# EasyEDA Pro project F446 V1.1.epro, schematic Schematic1_2
Board Name: F446plus; Create Date: 2024-09-19; Page Name: P1; Project Name: F446Plus v1.1; Schematic Name: Schematic1_2; Update Date: 2024-09-19
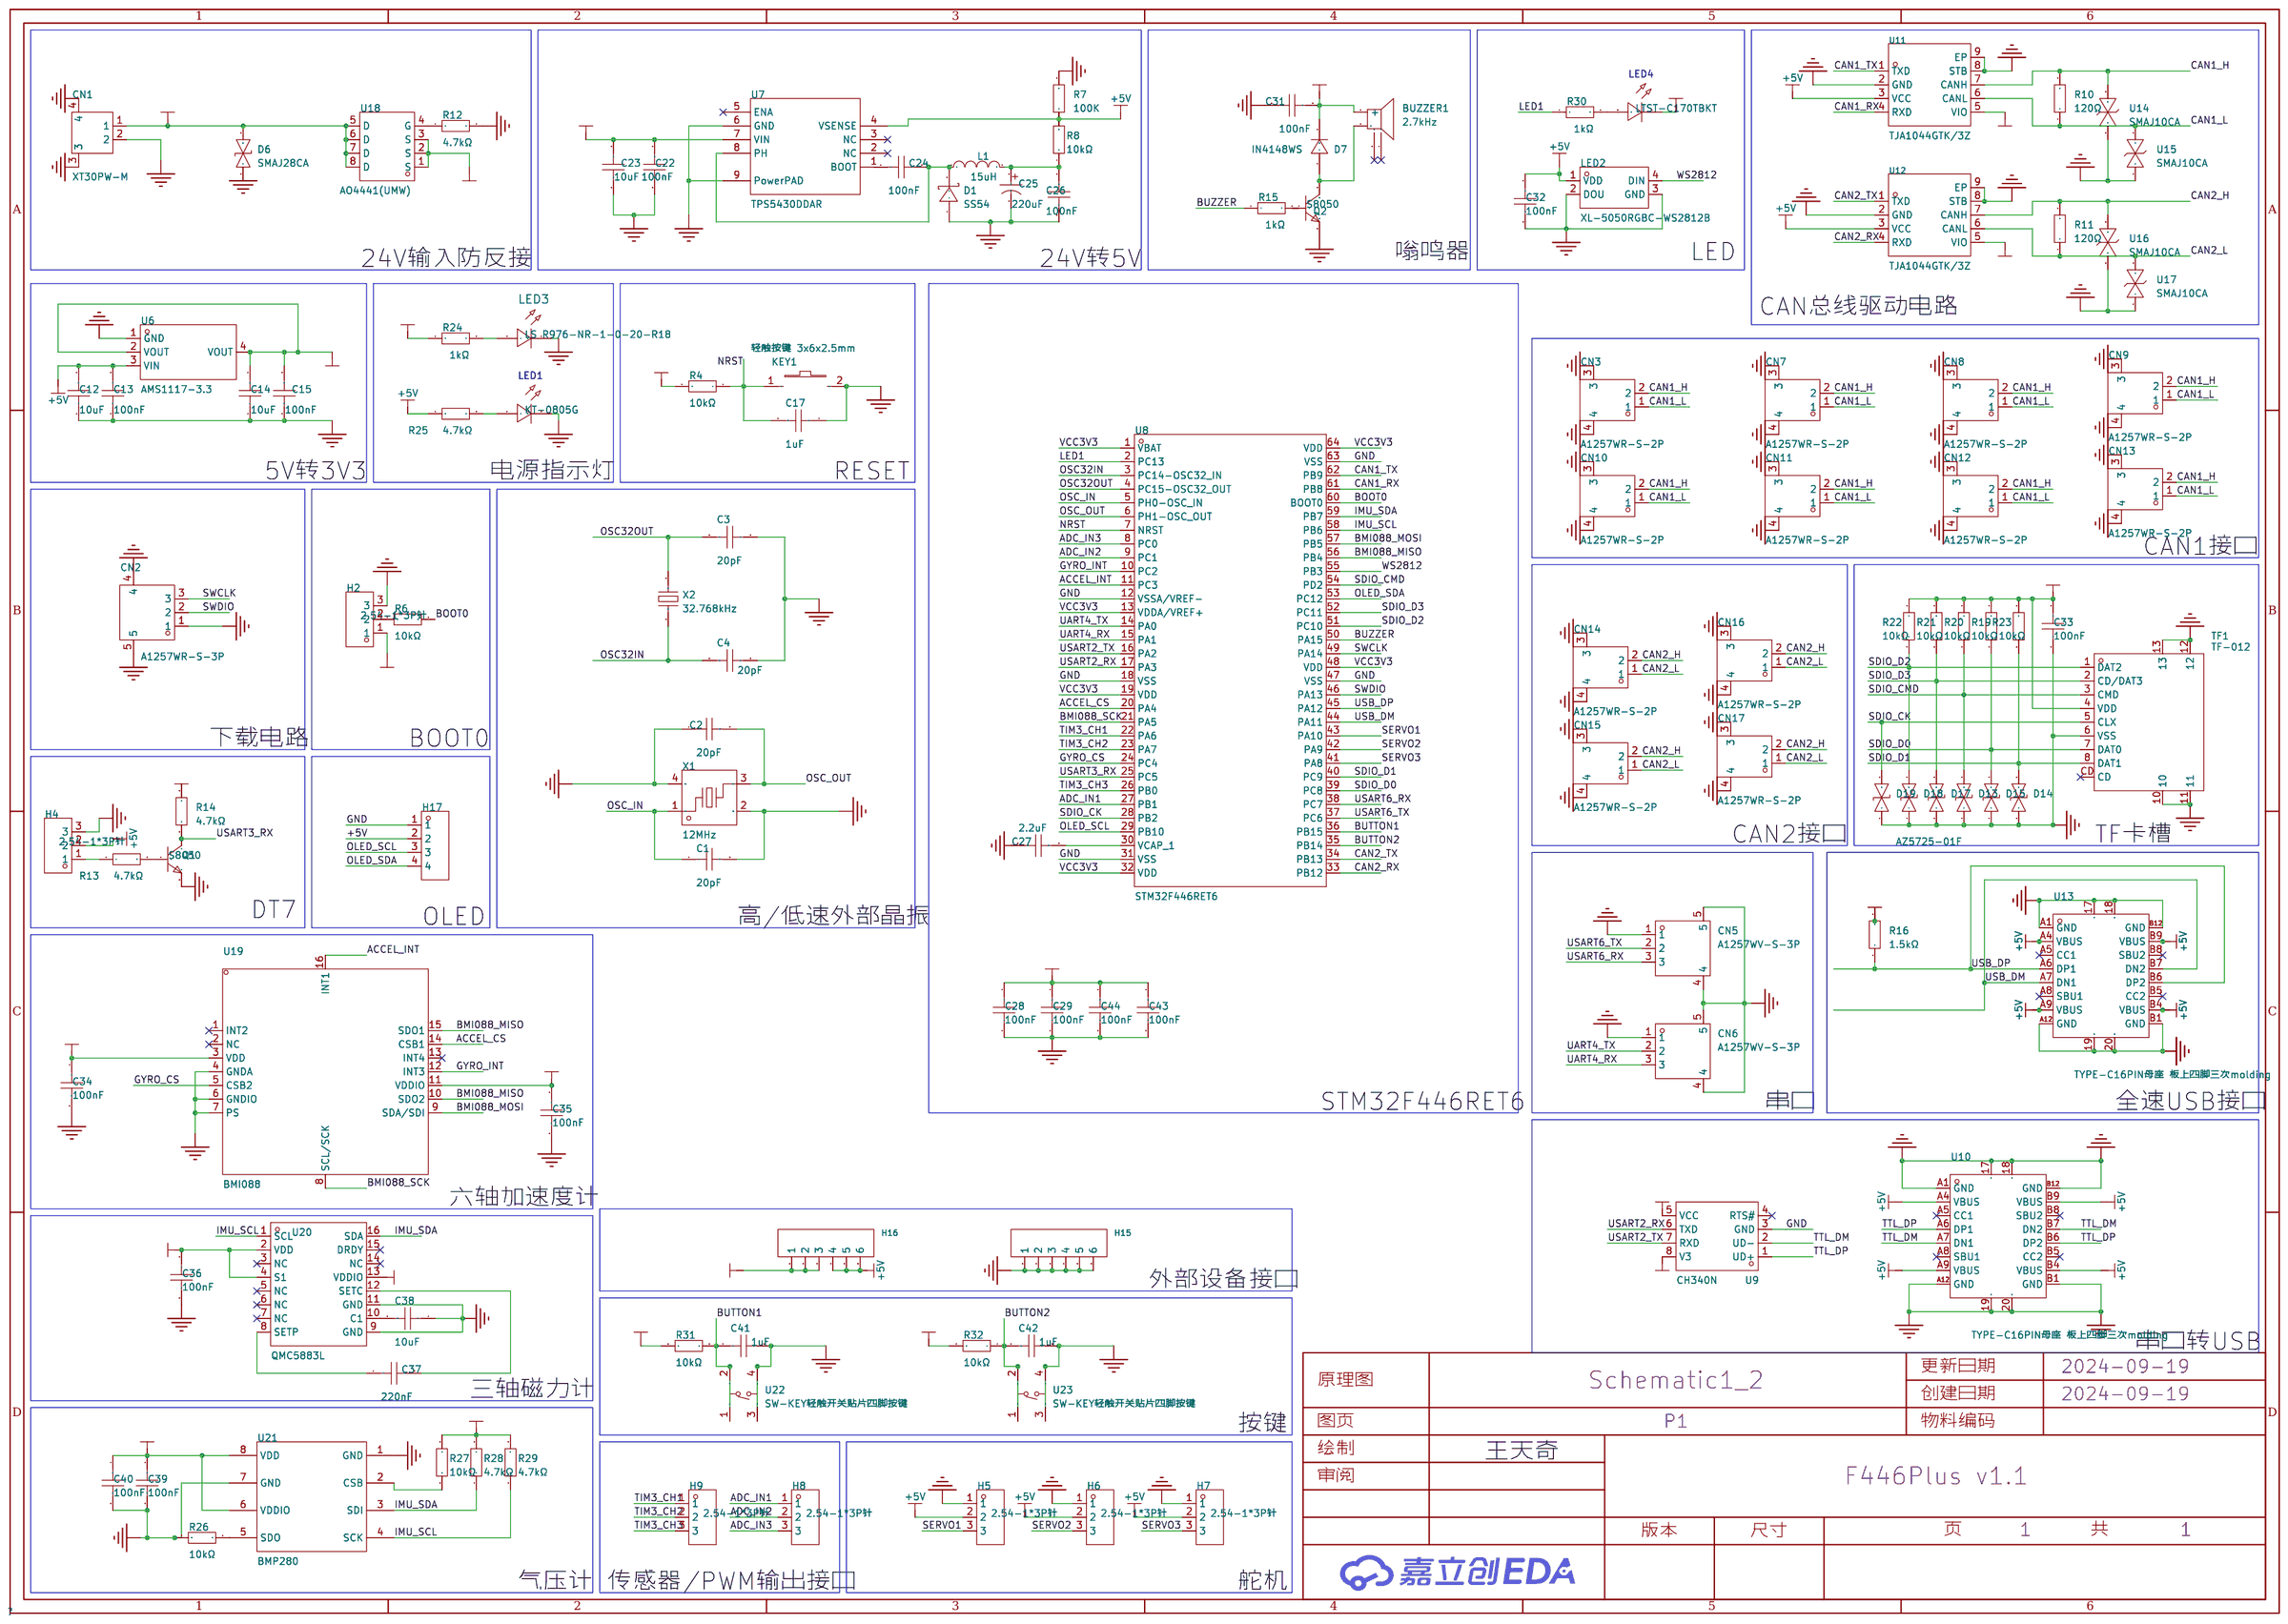
[diagram p0: schematic sheet]

## Parts
BUZZER1  2.7kHz  [BUZ-SMD_4P-L8.5-W8.5-P8.50-BR]
C1  20pF  [C0603]
C2  20pF  [C0603]
C3  20pF  [C0603]
C4  20pF  [C0603]
C12  10uF  [C0603]
C13  100nF  [C0603]
C14  10uF  [C0603]
C15  100nF  [C0603]
C17  1uF  [C0603]
C22  100nF  [C0603]
C23  10uF  [C0603]
C24  100nF  [C0603]
C25  220uF  [CAP-SMD_BD6.3-L6.6-W6.6-LS7.2-FD]
C26  100nF  [C0603]
C27  2.2uF  [C0603]
C28  100nF  [C0603]
C29  100nF  [C0603]
C31  100nF  [C0603]
C32  100nF  [C0603]
C33  100nF  [C0603]
C34  100nF  [C0603]
C35  100nF  [C0603]
C36  100nF  [C0603]
C37  220nF  [C0603]
C38  10uF  [C0603]
C39  100nF  [C0603]
C40  100nF  [C0603]
C41  1uF  [C0603]
C42  1uF  [C0603]
C43  100nF  [C0603]
C44  100nF  [C0603]
CN1  XT30PW-M  [CONN-TH_XT30PW-M]
CN2  A1257WR-S-3P  [CONN-SMD_A1257WR-S-3P]
CN3  A1257WR-S-2P  [CONN-SMD_A1257WR-S-2P]
CN5  A1257WV-S-3P  [CONN-SMD_A1257WV-S-3P]
CN6  A1257WV-S-3P  [CONN-SMD_A1257WV-S-3P]
CN7  A1257WR-S-2P  [CONN-SMD_A1257WR-S-2P]
CN8  A1257WR-S-2P  [CONN-SMD_A1257WR-S-2P]
CN9  A1257WR-S-2P  [CONN-SMD_A1257WR-S-2P]
CN10  A1257WR-S-2P  [CONN-SMD_A1257WR-S-2P]
CN11  A1257WR-S-2P  [CONN-SMD_A1257WR-S-2P]
CN12  A1257WR-S-2P  [CONN-SMD_A1257WR-S-2P]
CN13  A1257WR-S-2P  [CONN-SMD_A1257WR-S-2P]
CN14  A1257WR-S-2P  [CONN-SMD_A1257WR-S-2P]
CN15  A1257WR-S-2P  [CONN-SMD_A1257WR-S-2P]
CN16  A1257WR-S-2P  [CONN-SMD_A1257WR-S-2P]
CN17  A1257WR-S-2P  [CONN-SMD_A1257WR-S-2P]
D1  SS54  [SMA_L4.4-W2.8-LS5.4-R-RD]
D6  SMAJ28CA  [SMA_L4.3-W2.5-LS5.0-BI]
D7  IN4148WS  [SOD-323_L1.8-W1.3-LS2.5-RD]
D13  AZ5725-01F  [DFN-2L_L1.0-W0.6-P0.65-BI]
D14  AZ5725-01F  [DFN-2L_L1.0-W0.6-P0.65-BI]
D15  AZ5725-01F  [DFN-2L_L1.0-W0.6-P0.65-BI]
D17  AZ5725-01F  [DFN-2L_L1.0-W0.6-P0.65-BI]
D18  AZ5725-01F  [DFN-2L_L1.0-W0.6-P0.65-BI]
D19  AZ5725-01F  [DFN-2L_L1.0-W0.6-P0.65-BI]
H2  2.54-1*3P针  [HDR-TH_3P-P2.54-V-M-1]
H4  2.54-1*3P针  [HDR-TH_3P-P2.54-V-M-1]
H5  2.54-1*3P针  [HDR-TH_3P-P2.54-V-M-1]
H6  2.54-1*3P针  [HDR-TH_3P-P2.54-V-M-1]
H7  2.54-1*3P针  [HDR-TH_3P-P2.54-V-M-1]
H8  2.54-1*3P针  [HDR-TH_3P-P2.54-V-M-1]
H9  2.54-1*3P针  [HDR-TH_3P-P2.54-V-M-1]
H15  -  [HDR-TH_6P-P2.54-V-M-1]
H16  -  [HDR-TH_6P-P2.54-V-M-1]
H17  -  [HDR-TH_4P-P2.54-V-F]
KEY1  轻触按键 3x6x2.5mm  [SW-SMD_L6.0-W3.6-LS8.0]
L1  15uH  [IND-SMD_L7.0-W6.6_FXL0630]
LED1  KT-0805G  [LED0603-R-RD_WHITE]
LED2  XL-5050RGBC-WS2812B  [LED-SMD_4P-L5.0-W5.0-BL_XL-5050RGBC]
LED3  LS R976-NR-1-0-20-R18  [LED0603-R-RD_WHITE]
LED4  LTST-C170TBKT  [LED0603-R-RD_WHITE]
Q1  S8050  [SOT-23-3_L2.9-W1.6-P1.90-LS2.8-BR]
Q2  S8050  [SOT-23-3_L2.9-W1.6-P1.90-LS2.8-BR]
R4  10kΩ  [R0603]
R6  10kΩ  [R0603]
R7  100K  [R0603]
R8  10kΩ  [R0603]
R10  120Ω  [R0603]
R11  120Ω  [R0603]
R12  4.7kΩ  [R0603]
R13  4.7kΩ  [R0603]
R14  4.7kΩ  [R0603]
R15  1kΩ  [R0603]
R16  1.5kΩ  [R0603]
R19  10kΩ  [R0603]
R20  10kΩ  [R0603]
R21  10kΩ  [R0603]
R22  10kΩ  [R0603]
R23  10kΩ  [R0603]
R24  1kΩ  [R0603]
R25  4.7kΩ  [R0603]
R26  10kΩ  [R0603]
R27  10kΩ  [R0603]
R28  4.7kΩ  [R0603]
R29  4.7kΩ  [R0603]
R30  1kΩ  [R0603]
R31  10kΩ  [R0603]
R32  10kΩ  [R0603]
TF1  TF-012  [TF-SMD_TF-012]
U6  AMS1117-3.3  [SOT-223-3_L6.5-W3.4-P2.30-LS7.0-BR]
U7  TPS5430DDAR  [ESOP-8_L4.9-W3.9-P1.27-LS6.0-TL-EP]
U8  STM32F446RET6  [LQFP-64_L10.0-W10.0-P0.50-LS12.0-BL]
U9  CH340N  [SOP-8_L5.0-W4.0-P1.27-LS6.0-BL]
U10  TYPE-C16PIN母座 板上四脚三次molding  [USB-SMD_TYPE-C16PIN]
U11  TJA1044GTK/3Z  [HVSON-8_L3.0-W3.0-P0.65-BL-EP]
U12  TJA1044GTK/3Z  [HVSON-8_L3.0-W3.0-P0.65-BL-EP]
U13  TYPE-C16PIN母座 板上四脚三次molding  [USB-SMD_TYPE-C16PIN]
U14  SMAJ10CA  [DO-214AC_L4.3-W2.7-LS5.0-BI]
U15  SMAJ10CA  [DO-214AC_L4.3-W2.7-LS5.0-BI]
U16  SMAJ10CA  [DO-214AC_L4.3-W2.7-LS5.0-BI]
U17  SMAJ10CA  [DO-214AC_L4.3-W2.7-LS5.0-BI]
U18  AO4441(UMW)  [SOP-8_L4.9-W3.9-P1.27-LS6.0-BL]
U19  BMI088  [LGA-16_L4.5-W3.0-P0.50-BL]
U20  QMC5883L  [LGA-16_L3.0-W3.0-P0.50-BL_SQ]
U21  BMP280  [LGA-8_L2.5-W2.0-P0.65_AMP6127]
U22  SW-KEY轻触开关贴片四脚按键  [KEY-SMD_4P-L5.1-W5.1-P3.70-LS6.5]
U23  SW-KEY轻触开关贴片四脚按键  [KEY-SMD_4P-L5.1-W5.1-P3.70-LS6.5]
X1  12MHz  [OSC-SMD_4P-L3.2-W2.5-BL]
X2  32.768kHz  [OSC-SMD_L3.2-W1.5]

## Library data of the parts
BUZZER1 = MLT-8530_C94599: 驱动方式:无源(外部驱动);构造类型:电磁式;频率:2.7kHz;声压(SPL):80dB@5V,10cm;; LCSC Part Name: MLT-8530; Supplier Part: C94599; Manufacturer: 华能; Manufacturer Part: MLT-8530; Supplier Footprint: SMD,8.5x8.5mm; JLCPCB Part Class: 扩展库; Datasheet: https://atta.szlcsc.com/upload/public/pdf/source/20170522/1495448322339.pdf; Supplier: LCSC; Oscillator Circuit: 无源(外部驱动); Technology Type: 电磁式; Operating Voltage: 2.5V~4.5V; Sound Pressure Level (SPL): 80dB@5V,10cm; Length: 8.5mm; Width: 8.5mm; Height: 3.3mm
C1-C4 = CL21C200JBANNNC: 容值:20pF;精度:±5%;额定电压:50V;材质(温度系数):C0G;; LCSC Part Name: 20pF ±5% 50V; Supplier Part: C1798; Manufacturer: SAMSUNG(三星); Supplier Footprint: 0805; JLCPCB Part Class: Basic Part; Datasheet: https://atta.szlcsc.com/upload/public/pdf/source/20160218/1457707763339.pdf; Supplier: LCSC; Tolerance: ±5%; Voltage Rated: 50V; Temperature Coefficient: C0G
C12 C14 C23 C38 = CL21A106KAYNNNE_C15850: 容值:10uF;精度:±10%;额定电压:25V;材质(温度系数):X5R;; LCSC Part Name: 10uF ±10% 25V; Supplier Part: C15850; Manufacturer: SAMSUNG(三星); Manufacturer Part: CL21A106KAYNNNE; Supplier Footprint: 0805; JLCPCB Part Class: Basic Part; Datasheet: https://atta.szlcsc.com/upload/public/pdf/source/20160218/1457707763339.pdf; Supplier: LCSC; Tolerance: ±10%; Voltage Rated: 25V; Temperature Coefficient: X5R
C13 C15 C22 C24 C26 C28 C29 C31-C36 C39 C40 C43 C44 = CC0805KRX7R9BB104: 容值:100nF;精度:±10%;额定电压:50V;材质(温度系数):X7R;; LCSC Part Name: 100nF ±10% 50V; Supplier Part: C49678; Manufacturer: YAGEO(国巨); Supplier Footprint: 0805; JLCPCB Part Class: Basic Part; Datasheet: https://atta.szlcsc.com/upload/public/pdf/source/20180224/C181747_15194369449651363981.pdf; Supplier: LCSC; Tolerance: ±10%; Voltage Rated: 50V; Temperature Coefficient: X7R
C17 C41 C42 = CL21B105KBFNNNE: 容值:1uF;精度:±10%;额定电压:50V;材质(温度系数):X7R;; LCSC Part Name: 1uF ±10% 50V; Supplier Part: C28323; Manufacturer: SAMSUNG(三星); Supplier Footprint: 0805; JLCPCB Part Class: Basic Part; Datasheet: https://atta.szlcsc.com/upload/public/pdf/source/20160218/1457707763339.pdf; Supplier: LCSC; Tolerance: ±10%; Voltage Rated: 50V; Temperature Coefficient: X7R
C25 = 220uF: Supplier Part: C2941234; Supplier Footprint: -SMD6.3/5.8; JLCPCB Part Class: 扩展库; Datasheet: 2021-12-31/358175A/64285bfd35de4d0cb0247d8988fc0d91/220UF16V_2018-09-21.PDF; Supplier: LCSC
C27 = CL21A225KBQNNNE: 容值:2.2uF;精度:±10%;额定电压:50V;材质(温度系数):X5R;; LCSC Part Name: 2.2uF ±10% 50V; Supplier Part: C377773; Manufacturer: SAMSUNG(三星); Supplier Footprint: 0805; JLCPCB Part Class: Basic Part; Datasheet: https://atta.szlcsc.com/upload/public/pdf/source/20160218/1457707763339.pdf; Supplier: LCSC; Tolerance: ±10%; Voltage Rated: 50V; Temperature Coefficient: X5R
C37 = CL21B224KBFNNNE: 容值:220nF;精度:±10%;额定电压:50V;材质(温度系数):X7R;; LCSC Part Name: 220nF ±10% 50V; Supplier Part: C5378; Manufacturer: SAMSUNG(三星); Supplier Footprint: 0805; JLCPCB Part Class: Basic Part; Datasheet: https://atta.szlcsc.com/upload/public/pdf/source/20160218/1457707763339.pdf; Supplier: LCSC; Tolerance: ±10%; Voltage Rated: 50V; Temperature Coefficient: X7R
CN1 = XT30PW-M: 类别:-;类型1:-;; LCSC Part Name: AMASS(艾迈斯)航模插头 卧式弯脚 XT30PW-M公头; Supplier Part: C431092; Manufacturer: AMASS(艾迈斯); JLCPCB Part Class: 扩展库; Datasheet: https://atta.szlcsc.com/upload/public/pdf/source/20220222/6A9F22F7850E25B33E1BE430ADF8560B.pdf; Supplier: LCSC; Brand: 艾迈斯; Type: 航模插头; RatedVoltage: DC 500V; InterfaceType: 公头; RatedCurrent: 15A; RecommendedWireGauge: 16/18/20AWG; contact resistance: 1.2mΩ; specifications: 2pin
CN2 = A1257WR-S-3P: 插针结构:1x3P;间距:1.25mm;安装方式:-;参考系列:GH;总PIN数:3P;排数:1;每排PIN数:3;行距:-;触头材质:黄铜;; LCSC Part Name: 系列:GH 间距:1.25mm 1x3P; Supplier Part: C225126; Manufacturer: CJT(长江连接器); Supplier Footprint: SMD,P=1.25mm,卧贴; JLCPCB Part Class: 扩展库; Datasheet: https://atta.szlcsc.com/upload/public/pdf/source/20181008/C272994_C9E89FA8A36D0009CAD30AD8C59C2782.pdf; Supplier: LCSC; Pins Structure: 1x3P; Pitch: 1.25mm; Reference Series: GH; Number of Pins: 3P; Number of Rows: 1; Number of PINs Per Row: 3; Contact Material: 黄铜
CN3 CN7-CN17 = A1257WR-S-2P: 插针结构:1x2P;间距:1.25mm;安装方式:-;参考系列:GH;总PIN数:2P;排数:1;每排PIN数:2;行距:-;触头材质:黄铜;; LCSC Part Name: 系列:GH 间距:1.25mm 1x2P; Supplier Part: C225125; Manufacturer: CJT(长江连接器); Supplier Footprint: SMD,P=1.25mm,卧贴; JLCPCB Part Class: 扩展库; Datasheet: https://atta.szlcsc.com/upload/public/pdf/source/20181008/C272994_C9E89FA8A36D0009CAD30AD8C59C2782.pdf; Supplier: LCSC; Pins Structure: 1x2P; Pitch: 1.25mm; Reference Series: GH; Number of Pins: 2P; Number of Rows: 1; Number of PINs Per Row: 2; Contact Material: 黄铜
CN5 CN6 = A1257WV-S-3P: 插针结构:1x3P;间距:1.25mm;安装方式:-;参考系列:GH;总PIN数:3P;排数:1;每排PIN数:3;行距:-;触头材质:黄铜;; LCSC Part Name: 系列:GH 间距:1.25mm 1x3P; Supplier Part: C225119; Manufacturer: CJT(长江连接器); Supplier Footprint: SMD,P=1.25mm; JLCPCB Part Class: 扩展库; Datasheet: https://atta.szlcsc.com/upload/public/pdf/source/20181008/C272994_C9E89FA8A36D0009CAD30AD8C59C2782.pdf; Supplier: LCSC; Pins Structure: 1x3P; Pitch: 1.25mm; Reference Series: GH; Number of Pins: 3P; Number of Rows: 1; Number of PINs Per Row: 3; Contact Material: 黄铜
D1 = SS54_C22452: 二极管配置:独立式;正向压降(Vf):550mV@5A;直流反向耐压(Vr):40V;整流电流:5A;; LCSC Part Name: 电压:40V 电流:5A; Supplier Part: C22452; Manufacturer: MDD(辰达半导体); Supplier Footprint: SMA(DO-214AC); JLCPCB Part Class: 基础库; Datasheet: https://atta.szlcsc.com/upload/public/pdf/source/20230314/529CD85F9B31F69841D3A079BC07E377.pdf; Supplier: LCSC; Diode Configuration: 独立式; Forward Voltage (Vf@If): 550mV@5A; Reverse Voltage (Vr): 40V; Rectified Current: 5A; Reverse Leakage Current (Ir): 1mA@40V
D6 = SMAJ28CA_C353457: 反向截止电压(Vrwm):28V;最大钳位电压:45.4V;峰值脉冲电流(Ipp)@10/1000us:8.8A;击穿电压:31.1V;; LCSC Part Name: 双向TVS 28V截止 8.8A峰值脉冲; Supplier Part: C353457; Manufacturer: 晶导微电子; Supplier Footprint: SMA; JLCPCB Part Class: 扩展库; Datasheet: https://atta.szlcsc.com/upload/public/pdf/source/20190103/C353498_9C52E1B7CA7D9691073072057BB1DA1A.pdf; Supplier: LCSC; Reverse Stand-Off Voltage (Vrwm): 28V; Maximum Clamping Voltage: 45.4V; Peak Pulse Current (Ipp)@10/1000us: 8.8A; Breakdown Voltage: 31.1V; Reverse Leakage Current (Ir): 1uA; Type: TVS
D7 = IN4148WS: 二极管配置:独立式;正向压降(Vf):1V@10mA;直流反向耐压(Vr):100V;平均整流电流(Io):200mA;功率:200mW;反向恢复时间(trr):4ns;; LCSC Part Name: 电压:100V 电流:200mA; Supplier Part: C417545; Manufacturer: LRC(乐山无线电); Supplier Footprint: SOD-323; JLCPCB Part Class: 扩展库; Datasheet: https://atta.szlcsc.com/upload/public/pdf/source/20190911/C417545_CB999573A39316D3E44B0FF1B4B78E30.pdf; Supplier: LCSC; Diode Configuration: 独立式; Forward Voltage (Vf@If): 1V@10mA; Reverse Voltage (Vr): 100V; Average Rectified Current (Io): 200mA; Power Dissipation: 200mW; Reverse Leakage Current: 5uA@75V; Reverse Recovery Time (trr): 4ns
D13-D15 D17-D19 = AZ5725-01F: LCSC Part Name: ESD二极管; Supplier Part: C2936978; Manufacturer: TECH PUBLIC(台舟); Supplier Footprint: DFN1006-2; JLCPCB Part Class: 扩展库; Datasheet: https://atta.szlcsc.com/upload/public/pdf/source/20211227/A9A7998FC1FA86EA4F8BFE76327F88B0.pdf; Supplier: LCSC
H2 H4-H9 = 2.54-1*3P针: 插针结构:1x3P;间距:2.54mm;行距:-;圆针/方针:方针;安装类型:直插;排数:单排;总PIN位数:3P;额定电流:3A;额定电压:-;配合针长度:-;塑高:-;端接针长度:-;触头材质:-;触头镀层:-;工作温度范围:-40℃~+105℃;颜色:黑色;; LCSC Part Name: 间距:2.54mm 1x3P 直插 方针; Supplier Part: C49257; Manufacturer: BOOMELE(博穆精密); Supplier Footprint: 插件,P=2.54mm; JLCPCB Part Class: Extended Part; Datasheet: https://atta.szlcsc.com/upload/public/pdf/source/20221018/3E9408392E35E6F57A28985E5F7BF5C9.pdf; Supplier: LCSC; Pin Structure: 1x3P; Pitch: 2.54mm; Circluar Pins/Square Pins: 方针; Mounting Type: 直插; Number of Rows: 单排; Number of Pins: 3P; Current Rating (Max): 3A; Operating Temperature Range: -40℃~+105℃; Color: 黑色
H15 H16 = HDR-M_2.54_1x6P: Supplier Part: C37208; Supplier Footprint: 插件
H17 = HDR-F_2.54_1x4P: Supplier Part: C2718488; Supplier Footprint: 插件
KEY1 = 轻触按键 3x6x2.5mm: LCSC Part Name: 3x6x2.5 红头 耐高温; Supplier Part: C5382; Supplier Footprint: SMD; JLCPCB Part Class: 扩展库; Supplier: LCSC
L1 = FXL0630-150-M: 电感值:15uH;精度:±20%;额定电流:3A;饱和电流(Isat):4.5A;类型:一体成型电感;; LCSC Part Name: 15uH ±20% 4.5A; Supplier Part: C177243; Manufacturer: cjiang(长江微电); Supplier Footprint: SMD,6.6x7mm; JLCPCB Part Class: Extended Part; Datasheet: https://atta.szlcsc.com/upload/public/pdf/source/20230516/3A080F5AF8C87BB81C3BA86E5F60E51A.pdf; Supplier: LCSC; Tolerance: ±20%; Rated Current: 3A; Saturation Current (Isat): 4.5A; DC Resistance (DCR): 115mΩ; Type: 一体成型电感; Q @ Freq: 25@1MHz; Frequency - Self Resonant: 19MHz
LED1 = KT-0805G: 灯头类型:-;发光颜色:翠绿色;正向电压(VF):-;功率:-;正向电流:-;主波长:-;二极管配置:-;透镜颜色:-;色温:-;发光强度:-;发光角度:-;载带方式:-;工作温度:-;; LCSC Part Name: 0805 翠绿 高亮; Supplier Part: C2297; Manufacturer: KENTO; Supplier Footprint: 0805; JLCPCB Part Class: Basic Part; Datasheet: https://atta.szlcsc.com/upload/public/pdf/source/20170209/1486607340485.pdf; Supplier: LCSC; Emitted Color: 翠绿色
LED2 = XL-5050RGBC-WS2812B: 5050七彩幻彩透明贴片LED灯珠 5050 幻彩透明四脚 ws2812B 内置驱动IC; Supplier Part: C2843785; Manufacturer: XINGLIGHT(成兴光); Supplier Footprint: SMD5050; JLCPCB Part Class: 扩展库; Datasheet: https://atta.szlcsc.com/upload/public/pdf/source/20240412/E1004CAA80592E31D08BFE019083806F.pdf; Supplier: LCSC
LED3 = LS R976-NR-1-0-20-R18: LCSC Part Name: 0805红(雾状); Supplier Part: C2899997; Manufacturer: OSRAM(欧司朗); Supplier Footprint: 0805; JLCPCB Part Class: Extended Part; Datasheet: https://atta.szlcsc.com/upload/public/pdf/source/20220714/A56A54169E2209C0CCFAD963EE2FAFD1.pdf; Supplier: LCSC
LED4 = LTST-C170TBKT: 发光颜色:蓝色;正向电压(VF):3.3V;功率:76mW;正向电流:20mA;主波长:465nm~475nm;二极管配置:-;透镜颜色:无色透明透镜;色温:-;发光强度:104mcd;发光角度:130°;载带方式:-;工作温度:-20℃~+80℃;; LCSC Part Name: 蓝灯; Supplier Part: C98222; Manufacturer: LITEON(光宝); Supplier Footprint: 0805; JLCPCB Part Class: Extended Part; Datasheet: https://atta.szlcsc.com/upload/public/pdf/source/20171026/C98222_15089842934011059296.pdf; Supplier: LCSC; Emitted Color: 蓝色; Forward Voltage (VF): 3.3V; Power Dissipation: 76mW; Forward Current: 20mA; Dominant Wavelength: 465nm~475nm; Peak Wavelength: 468nm; Lens Color: 无色透明透镜; Luminous Intensity: 104mcd; Viewing Angle: 130°; Operating Temperature: -20℃~+80℃
Q1 Q2 = S8050_C181158: 晶体管类型:NPN;集电极电流(Ic):500mA;集射极击穿电压(Vceo):25V;功率(Pd):300mW;; LCSC Part Name: NPN 电流:500mA 耐压:25V; Supplier Part: C181158; Manufacturer: Hottech(合科泰); Supplier Footprint: SOT-23; JLCPCB Part Class: Extended Part; Datasheet: https://atta.szlcsc.com/upload/public/pdf/source/20220506/D987F39D56F2975D34EC7947E75C4ABC.pdf; Supplier: LCSC; Transistor Type: NPN; Collector Current (Ic): 500mA; Collector-Emitter Breakdown Voltage (Vceo): 25V; Power Dissipation (Pd): 300mW; Transition Frequency (fT): 150MHz; Collector Cut-Off Current (Icbo): 100nA; Collector-Emitter Saturation Voltage (VCE(sat)@Ic,Ib): 600mV@500mA,50mA
R4 R6 R8 R19-R23 R26 R27 R31 R32 = RC0805FR-0710KL: 电阻类型:厚膜电阻;阻值:10kΩ;精度:±1%;功率:125mW;最大工作电压:150V;温度系数:±100ppm/℃;; LCSC Part Name: 厚膜电阻 10kΩ ±1% 125mW; Supplier Part: C84376; Manufacturer: YAGEO(国巨); Supplier Footprint: 0805; JLCPCB Part Class: Extended Part; Datasheet: https://atta.szlcsc.com/upload/public/pdf/source/20170708/1499509500945.pdf; Supplier: LCSC; Type: 厚膜电阻; Tolerance: ±1%; Power(Watts): 125mW; Overload Voltage (Max): 150V; Temperature Coefficient: ±100ppm/℃; Operating Temperature Range: -55℃~+155℃
R7 = 0805W8F3241T5E: 电阻类型:厚膜电阻;阻值:3.24kΩ;精度:±1%;功率:125mW;最大工作电压:150V;温度系数:±100ppm/℃;; LCSC Part Name: 3.24kΩ ±1% 125mW 厚膜电阻; Supplier Part: C17609; Manufacturer: UNI-ROYAL(厚声); Supplier Footprint: 0805; JLCPCB Part Class: Extended Part; Datasheet: https://atta.szlcsc.com/upload/public/pdf/source/20200306/C422600_1E6D84923E4A46A82E41ADD87F860B5C.pdf; Supplier: LCSC; Type: 厚膜电阻; Tolerance: ±1%; Power(Watts): 125mW; Overload Voltage (Max): 150V; Temperature Coefficient: ±100ppm/℃; Operating Temperature Range: -55℃~+155℃
R10 R11 = 0805W8F1200T5E: 电阻类型:厚膜电阻;阻值:120Ω;精度:±1%;功率:125mW;最大工作电压:150V;温度系数:±100ppm/℃;; LCSC Part Name: 120Ω ±1% 125mW 厚膜电阻; Supplier Part: C17437; Manufacturer: UNI-ROYAL(厚声); Supplier Footprint: 0805; JLCPCB Part Class: Basic Part; Datasheet: https://atta.szlcsc.com/upload/public/pdf/source/20200306/C422600_1E6D84923E4A46A82E41ADD87F860B5C.pdf; Supplier: LCSC; Type: 厚膜电阻; Tolerance: ±1%; Power(Watts): 125mW; Overload Voltage (Max): 150V; Temperature Coefficient: ±100ppm/℃; Operating Temperature Range: -55℃~+155℃
R12-R14 R25 R28 R29 = 0805W8J0472T5E: 电阻类型:厚膜电阻;阻值:4.7kΩ;精度:±5%;功率:125mW;最大工作电压:150V;温度系数:±100ppm/℃;; LCSC Part Name: 4.7kΩ ±5% 125mW 厚膜电阻; Supplier Part: C26022; Manufacturer: UNI-ROYAL(厚声); Supplier Footprint: 0805; JLCPCB Part Class: Extended Part; Datasheet: https://atta.szlcsc.com/upload/public/pdf/source/20200306/C422600_1E6D84923E4A46A82E41ADD87F860B5C.pdf; Supplier: LCSC; Type: 厚膜电阻; Tolerance: ±5%; Power(Watts): 125mW; Overload Voltage (Max): 150V; Temperature Coefficient: ±100ppm/℃; Operating Temperature Range: -55℃~+155℃
R15 R24 R30 = 0805W8F1001T5E: 电阻类型:厚膜电阻;阻值:1kΩ;精度:±1%;功率:125mW;最大工作电压:150V;温度系数:±100ppm/℃;; LCSC Part Name: 1kΩ ±1% 125mW 厚膜电阻; Supplier Part: C17513; Manufacturer: UNI-ROYAL(厚声); Supplier Footprint: 0805; JLCPCB Part Class: Basic Part; Datasheet: https://atta.szlcsc.com/upload/public/pdf/source/20200306/C422600_1E6D84923E4A46A82E41ADD87F860B5C.pdf; Supplier: LCSC; Type: 厚膜电阻; Tolerance: ±1%; Power(Watts): 125mW; Overload Voltage (Max): 150V; Temperature Coefficient: ±100ppm/℃; Operating Temperature Range: -55℃~+155℃
R16 = 0805W8F1501T5E: 电阻类型:厚膜电阻;阻值:1.5kΩ;精度:±1%;功率:125mW;最大工作电压:150V;温度系数:±100ppm/℃;; LCSC Part Name: 1.5kΩ ±1% 125mW 厚膜电阻; Supplier Part: C4310; Manufacturer: UNI-ROYAL(厚声); Supplier Footprint: 0805; JLCPCB Part Class: Basic Part; Datasheet: https://atta.szlcsc.com/upload/public/pdf/source/20200306/C422600_1E6D84923E4A46A82E41ADD87F860B5C.pdf; Supplier: LCSC; Type: 厚膜电阻; Tolerance: ±1%; Power(Watts): 125mW; Overload Voltage (Max): 150V; Temperature Coefficient: ±100ppm/℃; Operating Temperature Range: -55℃~+155℃
TF1 = TF-012: 卡连接方式:自弹式;卡类型:MicroSD卡(TF卡);连接器类型:卡座;本体最大高度:2mm;触头镀层:金;工作温度范围:-25℃~+85℃;; LCSC Part Name: 自弹式 MicroSD卡(TF卡) 卡座; Supplier Part: C410350; Manufacturer: HANBO(汉博); Supplier Footprint: SMD; JLCPCB Part Class: 扩展库; Datasheet: https://atta.szlcsc.com/upload/public/pdf/source/20221111/BB81CC7778DE10777740A0A95254EE6F.pdf; Supplier: LCSC; Card Connection Mode: 自弹式; Card Type: MicroSD卡(TF卡); Connector Type: 卡座; Maximum Body Height: 2mm; Contact Plating: 金; Operating Temperature Range: -25℃~+85℃
U6 = AMS1117-3.3_C6186: 输出类型:固定;最大输入电压:-;输出电压:3.3V;最大输出电流:1A;电源纹波抑制比(PSRR):72dB@(120Hz);输出极性:正极;; LCSC Part Name: 输出3.3V 1A; Supplier Part: C6186; Manufacturer: AMS; Supplier Footprint: SOT-223; JLCPCB Part Class: 基础库; Datasheet: https://atta.szlcsc.com/upload/public/pdf/source/20180727/C6186_7A095716F0823C02F1997A905E26C086.pdf; Supplier: LCSC; Output Type: 固定; Output Voltage: 3.3V; MAX Output Current: 1A; Power Supply Rejection Ratio (PSRR): 72dB@(120Hz); Dropout Voltage: 1.3V@(800mA); Output Polarity: 正极; Number of Outputs: 1
U7 = TPS5430DDAR: 功能类型:降压型;输出类型:可调;输入电压:5.5V~36V;输出电压:1.221V~32.04V;输出电流(最大值):3A;; LCSC Part Name: 降压 3A 36V; Supplier Part: C9864; Manufacturer: TI(德州仪器); Supplier Footprint: SOIC-8-EP; JLCPCB Part Class: 基础库; Datasheet: https://www.ti.com/cn/lit/gpn/tps5430; Supplier: LCSC; Function: 降压型; Output Type: 可调; Input Voltage: 5.5V~36V; Output Voltage: 1.221V~32.04V; Output Current (Max): 3A; Switching Frequency: 500kHz; Operating Temperature: -40℃~+125℃@(TJ); Synchronous Rectification: 否; Number of Outputs: 1; Topology: 降压式; Switch tube (built-in/external): 内置
U8 = STM32F446RET6: CPU内核:CM4;程序存储容量:512KB;RAM总容量:128KB;GPIO端口数量:50;工作电压范围:1.7V~3.6V;CPU最大主频:180MHz;程序存储器类型:FLASH;; LCSC Part Name: STM32F446RET6 MSL=3; Supplier Part: C69336; Manufacturer: ST(意法半导体); Supplier Footprint: LQFP-64(10x10); JLCPCB Part Class: 扩展库; Datasheet: https://atta.szlcsc.com/upload/public/pdf/source/20170518/1495086068896.pdf; Supplier: LCSC; CPU Core: CM4; Program Storage Size: 512KB; RAM Size: 128KB; GPIO Ports Number: 50; Operating Voltage Range: 1.7V~3.6V; CPU Maximum Speed: 180MHz; Program Memory Type: FLASH; Operating Temperature Range: -40℃~+85℃; ADC (Bit): 12bit; DAC (Bit): 12bit; Universal Serial Bus: 有; Peripheral/Function: PWM；PWM；低电压检测; Watchdog: 有; Infrared Data Association: 有; Low-Voltage Detect: 有; Direct Memory Access: 有; Internal Oscillator: 有
U9 = CH340N_C506813: 应用功能:-;接口协议:-;; LCSC Part Name: USB转串口芯片 CH340; Supplier Part: C506813; Manufacturer: WCH(南京沁恒); Supplier Footprint: SOP-8; JLCPCB Part Class: 扩展库; Datasheet: https://atta.szlcsc.com/upload/public/pdf/source/20200819/C84681_ADBED554CE321879DBD6B1D06488689C.pdf; Supplier: LCSC
U10 U13 = TYPE-C16PIN母座 板上四脚三次molding: Supplier Part: C9900000202; Supplier Footprint: TYPE-C16PIN; JLCPCB Part Class: Extended Part; Supplier: LCSC
U11 U12 = TJA1044GTK/3Z: 类型:-;; Supplier Part: C2157795; Manufacturer: NXP(恩智浦); Supplier Footprint: HVSON-8-EP(3x3); JLCPCB Part Class: 扩展库; Datasheet: https://atta.szlcsc.com/upload/public/pdf/source/20180227/C181725_15196977259441370130.pdf; Supplier: LCSC
U14-U17 = SMAJ10CA_C19077530: 极性:双向;反向截止电压(Vrwm):10V;最大钳位电压:17V;峰值脉冲电流(Ipp)@10/1000us:23.5A;峰值脉冲功率(Ppp)@10/1000us:400W;击穿电压:12.3V;; Supplier Part: C19077530; Manufacturer: 宏迦橙; Supplier Footprint: SMA; JLCPCB Part Class: 扩展库; Datasheet: https://atta.szlcsc.com/upload/public/pdf/source/20231129/0C227A9DBE0C7CC8A214145DDE9DB6E3.pdf; Supplier: LCSC; polarity: 双向; Reverse Stand-Off Voltage (Vrwm): 10V; Maximum Clamping Voltage: 17V; Peak Pulse Current (Ipp)@10/1000us: 23.5A; Peak Pulse Power Dissipation (Ppp)@10/1000us: 400W; Breakdown Voltage: 12.3V; Reverse Leakage Current (Ir): 5uA; Operating Temperature: -55℃~+155℃; Type: TVS
U18 = AO4441(UMW): LCSC Part Name: AO4441; Supplier Part: C5447653; Manufacturer: UMW(友台半导体); Supplier Footprint: SOP-8; Datasheet: https://atta.szlcsc.com/upload/public/pdf/source/20231109/A658EA3DE7C4AD03D844DCD51B9B6F86.pdf; Supplier: LCSC
U19 = BMI088: 传感器类型:加速度计陀螺仪;; Supplier Part: C194919; Manufacturer: Bosch(博世); Supplier Footprint: LGA-16(3x4.5); JLCPCB Part Class: 扩展库; Datasheet: https://atta.szlcsc.com/upload/public/pdf/source/20180628/C194919_66CCF125FF968C218A4D358C68AC68D6.pdf; Supplier: LCSC; Sensor Type: 加速度计陀螺仪; Operating Temperature: -40℃~+85℃
U20 = QMC5883L: LCSC Part Name: 三轴磁传感器; Supplier Part: C976032; Manufacturer: QST(上海矽睿); Supplier Footprint: LGA-16(3x3); JLCPCB Part Class: 扩展库; Datasheet: https://atta.szlcsc.com/upload/public/pdf/source/20201217/C976032_5B9A2F3901E175046CBA037B1F18A1F2.pdf; Supplier: LCSC
U21 = BMP280: Bosch气压传感器新品，可测量大气压力，带高精度温度测量，可校准精确计算海拔高度。I2C或SPI接口，宽量程（300-1100hpa），精度高; Supplier Part: C83291; Manufacturer: Bosch(博世); Supplier Footprint: LGA-8(2x2.5); JLCPCB Part Class: 扩展库; Datasheet: https://atta.szlcsc.com/upload/public/pdf/source/20200702/C83291_F39E84AB7DFC569A4C7554F8659640A1.pdf; Supplier: LCSC
U22 U23 = SW-KEY轻触开关贴片四脚按键: Supplier Part: C9900002561; Supplier Footprint: SMD-4_L5.1-W5.1-P3.70-LS6.5; JLCPCB Part Class: 扩展库; Supplier: LCSC
X1 = 7B012000M01: 晶振类型:贴片晶振;频率:12MHz;常温频差:±10ppm;外接负载电容:12pF;频率稳定度(全温):±20ppm;; LCSC Part Name: 12MHz ±10ppm 12pF; Supplier Part: C654949; Manufacturer: HD(浩都频率); Supplier Footprint: SMD3225-4P; JLCPCB Part Class: 扩展库; Datasheet: https://atta.szlcsc.com/upload/public/pdf/source/20220223/8471DDD7AD9521F45DA205F3B23502E0.pdf; Supplier: LCSC; Crystal Type: 贴片晶振; Normal temperature Frequency Tolerance: ±10ppm; External load capacitor: 12pF; Frequency Stability(Full temperature range): ±20ppm
X2 = X321532768KGD2SI: 晶振类型:贴片晶振;频率:32.768kHz;常温频差:±20ppm;外接负载电容:12.5pF;频率稳定度(全温):-;; LCSC Part Name: 32.768kHz ±20ppm 12.5pF; Supplier Part: C620155; Manufacturer: YXC(扬兴晶振); Supplier Footprint: SMD3215-2P; JLCPCB Part Class: 扩展库; Datasheet: https://atta.szlcsc.com/upload/public/pdf/source/20240329/3A7650FD985DD0DE85694D3785AB4916.pdf; Supplier: LCSC; Crystal Type: 贴片晶振; Normal temperature Frequency Tolerance: ±20ppm; External load capacitor: 12.5pF; Operating Temperature: -40℃~+85℃

## Nets
+5V: C12.2 C13.2 C32.1 H4.2 H5.2 H6.2 H7.2 H16.4 H16.5 H16.6 H17.2 LED2.1(VDD) R7.1 R8.2 R25.1 U6.3(VIN) U7.4(VSENSE) U10.A4(VBUS) U10.A9(VBUS) U10.B4(VBUS) U10.B9(VBUS) U11.3(VCC) U12.3(VCC) U13.A4(VBUS) U13.A9(VBUS) U13.B4(VBUS) U13.B9(VBUS)
GND: C1.2 C2.1 C3.2 C4.2 C12.1 C13.1 C14.1 C15.1 C17.1 C22.1 C23.1 C25.2 C26.1 C27.2 C28.2 C29.2 C31.1 C32.2 C33.2 C34.2 C35.2 C36.2 C38.1 C39.2 C40.2 C41.2 C42.2 C43.2 C44.2 CN1.2 CN1.3 CN1.4 CN2.1 CN2.4 CN2.5 CN3.3 CN3.4 CN5.1 CN5.4 CN5.5 CN6.1 CN6.4 CN6.5 CN7.3 CN7.4 CN8.3 CN8.4 CN9.3 CN9.4 CN10.3 CN10.4 CN11.3 CN11.4 CN12.3 CN12.4 CN13.3 CN13.4 CN14.3 CN14.4 CN15.3 CN15.4 CN16.3 CN16.4 CN17.3 CN17.4 D1.1(A) D6.1 D13.1 D14.1 D15.1 D17.1 D18.1 D19.1 H2.3 H4.3 H5.1 H6.1 H7.1 H15.1 H15.2 H15.3 H15.4 H15.5 H15.6 H17.1 KEY1.2 LED1.1(C) LED2.2(DOU) LED2.3(GND) LED3.1(C) Q1.2 Q2.2 R7.2 R12.2 R26.2 TF1.6(VSS) TF1.10 TF1.11 TF1.12 TF1.13 U6.1(GND) U7.6(GND) U7.9(PowerPAD) U8.12(VSSA/VREF-) U8.18(VSS) U8.31(VSS) U8.47(VSS) U8.63(VSS) U9.3(GND) U10.17 U10.18 U10.19 U10.20 U10.A1(GND) U10.A12(GND) U10.B1(GND) U10.B12(GND) U11.2(GND) U11.8(STB) U11.9(EP) U12.2(GND) U12.8(STB) U12.9(EP) U13.17 U13.18 U13.19 U13.20 U13.A1(GND) U13.A12(GND) U13.B1(GND) U13.B12(GND) U14.1 U15.1 U16.1 U17.1 U19.4(GNDA) U19.6(GNDIO) U19.7(PS) U20.9(GND) U20.11(GND) U21.1(GND) U21.7(GND) U22.3 U22.4 U23.3 U23.4 X1.2(GND) X1.4(GND)
VCC3V3: BUZZER1.1(+) C14.2 C15.2 C28.1 C29.1 C31.2 C33.1 C34.1 C35.1 C36.1 C39.1 C40.1 C43.1 C44.1 D7.1(C) H2.1 H16.1 H16.2 H16.3 LED4.1(C) R4.2 R14.2 R16.2 R19.1 R20.1 R21.1 R22.1 R23.1 R24.1 R27.1 R28.2 R29.2 R31.2 R32.2 TF1.4(VDD) U6.2(VOUT) U6.4(VOUT) U8.1(VBAT) U8.13(VDDA/VREF+) U8.19(VDD) U8.32(VDD) U8.48(VDD) U8.64(VDD) U9.5(VCC) U9.8(V3) U11.5(VIO) U12.5(VIO) U19.3(VDD) U19.11(VDDIO) U20.2(VDD) U20.4(S1) U20.13(VDDIO) U21.6(VDDIO) U21.8(VDD)
VCC24V: C22.2 C23.2 U7.7(VIN) U18.1(S) U18.2(S) U18.3(S)
ACCEL_CS: U8.20(PA4) U19.14(CSB1)
ACCEL_INT: U8.11(PC3) U19.16(INT1)
ADC_IN1: H8.1 U8.27(PB1)
ADC_IN2: H8.2 U8.9(PC1)
ADC_IN3: H8.3 U8.8(PC0)
BMI088_MISO: U8.56(PB4) U19.10(SDO2) U19.15(SDO1)
BMI088_MOSI: U8.57(PB5) U19.9(SDA/SDI)
BMI088_SCK: U8.21(PA5) U19.8(SCL/SCK)
BOOT0: R6.2 U8.60(BOOT0)
BUTTON1: C41.1 R31.1 U8.36(PB15) U22.1 U22.2
BUTTON2: C42.1 R32.1 U8.35(PB14) U23.1 U23.2
BUZZER: R15.1 U8.50(PA15)
CAN1_H: CN3.2 CN7.2 CN8.2 CN9.2 CN10.2 CN11.2 CN12.2 CN13.2 R10.2 U11.7(CANH) U14.2
CAN1_L: CN3.1 CN7.1 CN8.1 CN9.1 CN10.1 CN11.1 CN12.1 CN13.1 R10.1 U11.6(CANL) U15.2
CAN1_RX: U8.61(PB8) U11.4(RXD)
CAN1_TX: U8.62(PB9) U11.1(TXD)
CAN2_H: CN14.2 CN15.2 CN16.2 CN17.2 R11.2 U12.7(CANH) U16.2
CAN2_L: CN14.1 CN15.1 CN16.1 CN17.1 R11.1 U12.6(CANL) U17.2
CAN2_RX: U8.33(PB12) U12.4(RXD)
CAN2_TX: U8.34(PB13) U12.1(TXD)
GYRO_CS: U8.24(PC4) U19.5(CSB2)
GYRO_INT: U8.10(PC2) U19.12(INT3)
IMU_SCL: R29.1 U8.58(PB6) U20.1(SCL) U21.4(SCK)
IMU_SDA: R28.1 U8.59(PB7) U20.16(SDA) U21.3(SDI)
LED1: R30.1 U8.2(PC13)
NRST: C17.2 KEY1.1 R4.1 U8.7(NRST)
OLED_SCL: H17.3 U8.29(PB10)
OLED_SDA: H17.4 U8.53(PC12)
OSC32IN: C4.1 U8.3(PC14-OSC32_IN) X2.1
OSC32OUT: C3.1 U8.4(PC15-OSC32_OUT) X2.2
OSC_IN: C1.1 U8.5(PH0-OSC_IN) X1.1(IN)
OSC_OUT: C2.2 U8.6(PH1-OSC_OUT) X1.3(OUT)
POWER: CN1.1 D6.2 U18.5(D) U18.6(D) U18.7(D) U18.8(D)
SDIO_CK: D19.2 TF1.5(CLX) U8.28(PB2)
SDIO_CMD: D13.2 R20.2 TF1.3(CMD) U8.54(PD2)
SDIO_D0: D15.2 R19.2 TF1.7(DAT0) U8.39(PC8)
SDIO_D1: D14.2 R23.2 TF1.8(DAT1) U8.40(PC9)
SDIO_D2: D18.2 R22.2 TF1.1(DAT2) U8.51(PC10)
SDIO_D3: D17.2 R21.2 TF1.2(CD/DAT3) U8.52(PC11)
SERVO1: H5.3 U8.43(PA10)
SERVO2: H6.3 U8.42(PA9)
SERVO3: H7.3 U8.41(PA8)
SWCLK: CN2.3 U8.49(PA14)
SWDIO: CN2.2 U8.46(PA13)
TIM3_CH1: H9.1 U8.22(PA6)
TIM3_CH2: H9.2 U8.23(PA7)
TIM3_CH3: H9.3 U8.26(PB0)
TTL_DM: U9.2(UD-) U10.A7(DN1) U10.B7(DN2)
TTL_DP: U9.1(UD+) U10.A6(DP1) U10.B6(DP2)
UART4_RX: CN6.3 U8.15(PA1)
UART4_TX: CN6.2 U8.14(PA0)
USART2_RX: U8.17(PA3) U9.6(TXD)
USART2_TX: U8.16(PA2) U9.7(RXD)
USART3_RX: Q1.3 R14.1 U8.25(PC5)
USART6_RX: CN5.3 U8.38(PC7)
USART6_TX: CN5.2 U8.37(PC6)
USB_DM: U8.44(PA11) U13.A7(DN1) U13.B7(DN2)
USB_DP: R16.1 U8.45(PA12) U13.A6(DP1) U13.B6(DP2)
WS2812: LED2.4(DIN) U8.55(PB3)
$1N10170: C24.1 U7.1(BOOT)
$1N10572: C24.2 D1.2(K) L1.1 U7.8(PH)
$1N10581: C25.1 C26.2 L1.2 R8.1
$1N17339: R12.1 U18.4(G)
$1N17601: Q1.1 R13.2
$1N17854: BUZZER1.2 D7.2(A) Q2.3
$1N17986: Q2.1 R15.2
$1N20666: C37.2 U20.12(SETC)
$1N20667: C37.1 U20.8(SETP)
$1N20697: C38.2 U20.10(C1)
$1N20825: R26.1 U21.5(SDO)
$1N21033: R27.2 U21.2(CSB)
Net-(C27-1): C27.1 U8.30(VCAP_1)
Net-(H2-2): H2.2 R6.1
Net-(H4-1): H4.1 R13.1
Net-(LED1-2): LED1.2(A) R25.2
Net-(LED3-2): LED3.2(A) R24.2
Net-(LED4-2): LED4.2(A) R30.2

Not connected (* = marked no-connect by the designer): BUZZER1 3* 4*; TF1 CD*; U7 2(NC)* 3(NC)* 5(ENA)*; U9 4(RTS#)*; U10 A5(CC1)* A8(SBU1)* B5(CC2)* B8(SBU2)*; U13 A5(CC1)* A8(SBU1)* B5(CC2)* B8(SBU2)*; U19 1(INT2)* 2(NC)* 13(INT4)*; U20 3(NC)* 5(NC)* 6(NC)* 7(NC)* 14(NC)* 15(DRDY)*

## Notes on the sheet
- 24V输入防反接
- 24V转5V
- 嗡鸣器
- LED
- CAN总线驱动电路
- 5V转3V3
- 电源指示灯
- RESET
- CAN1接口
- 下载电路
- BOOT0
- CAN2接口
- TF卡槽
- DT7
- OLED
- 高/低速外部晶振
- STM32F446RET6
- 串口
- 全速USB接口
- 六轴加速度计
- 外部设备接口
- 串口转USB
- 三轴磁力计
- 按键
- 王天奇
- 气压计
- 传感器/PWM输出接口
- 舵机
